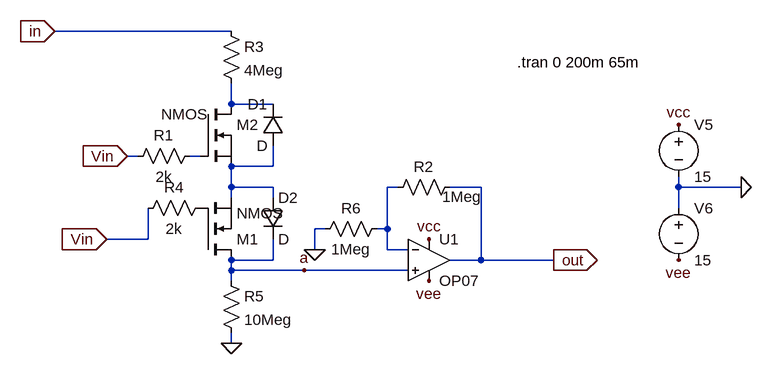
[diagram p0: schematic Voltage_controlled_switch_1.asc]
Voltage_controlled_switch_1.asc, the LTspice schematic file:
Version 4.1
SHEET 1 1524 680
WIRE 448 0 176 0
WIRE 448 112 448 80
WIRE 512 112 448 112
WIRE 304 192 288 192
WIRE 400 192 384 192
WIRE 512 208 512 176
WIRE 512 208 448 208
WIRE 448 240 448 208
WIRE 512 240 448 240
WIRE 704 240 688 240
WIRE 832 240 784 240
WIRE 1136 240 1136 224
WIRE 1232 240 1136 240
WIRE 448 256 448 240
WIRE 512 256 512 240
WIRE 1136 272 1136 240
WIRE 592 304 576 304
WIRE 688 304 688 240
WIRE 688 304 672 304
WIRE 320 320 320 272
WIRE 320 320 256 320
WIRE 576 336 576 304
WIRE 688 336 688 304
WIRE 720 336 688 336
WIRE 512 352 512 320
WIRE 512 352 448 352
WIRE 832 352 832 240
WIRE 832 352 784 352
WIRE 944 352 832 352
WIRE 448 368 448 352
WIRE 560 368 448 368
WIRE 720 368 560 368
WIRE 448 384 448 368
WIRE 448 480 448 464
FLAG 448 480 0
FLAG 576 336 0
FLAG 1232 240 0
FLAG 1136 144 vcc
FLAG 752 320 vcc
FLAG 1136 352 vee
FLAG 752 384 vee
FLAG 560 368 a
FLAG 176 0 in
IOPIN 176 0 In
FLAG 944 352 out
IOPIN 944 352 Out
FLAG 288 192 Vin
IOPIN 288 192 In
FLAG 256 320 Vin
IOPIN 256 320 In
SYMBOL res 400 176 R90
WINDOW 0 0 56 VBottom 2
WINDOW 3 32 56 VTop 2
SYMATTR InstName R1
SYMATTR Value 2k
SYMBOL res 800 224 R90
WINDOW 0 0 56 VBottom 2
WINDOW 3 15 -3 VTop 2
SYMATTR InstName R2
SYMATTR Value 1Meg
SYMBOL res 432 -16 R0
SYMATTR InstName R3
SYMATTR Value 4Meg
SYMBOL nmos 400 112 R0
WINDOW 3 -60 16 Left 2
SYMATTR InstName M2
SYMBOL nmos 400 352 M180
SYMATTR InstName M1
SYMBOL diode 496 256 R0
SYMATTR InstName D2
SYMBOL res 416 256 R90
WINDOW 0 0 56 VBottom 2
WINDOW 3 32 56 VTop 2
SYMATTR InstName R4
SYMATTR Value 2k
SYMBOL res 432 368 R0
SYMATTR InstName R5
SYMATTR Value 10Meg
SYMBOL diode 528 176 R180
WINDOW 0 24 64 Left 2
WINDOW 3 24 0 Left 2
SYMATTR InstName D1
SYMBOL OpAmps\\OP07 752 288 R0
SYMATTR InstName U1
SYMBOL res 688 288 R90
WINDOW 0 0 56 VBottom 2
WINDOW 3 32 56 VTop 2
SYMATTR InstName R6
SYMATTR Value 1Meg
SYMBOL voltage 1136 128 R0
WINDOW 123 0 0 Left 0
WINDOW 39 0 0 Left 0
SYMATTR InstName V5
SYMATTR Value 15
SYMBOL voltage 1136 256 R0
WINDOW 123 0 0 Left 0
WINDOW 39 0 0 Left 0
SYMATTR InstName V6
SYMATTR Value 15
TEXT 888 48 Left 2 !.tran 0 200m 65m

The netlist it stands for:
* Voltage_controlled_switch_1.asc
R1 N002 Vin 2k
R2 out N004 1Meg
R3 in N001 4Meg
M2 N001 N002 N003 N003 NMOS
M1 a P001 N003 N003 NMOS
D2 N003 a D
R4 P001 Vin 2k
R5 a 0 10Meg
D1 N003 N001 D
X§U1 a N004 vcc vee out LT1001  ; OP07, pins In+ In- V+ V- OUT
R6 N004 0 1Meg
V5 vcc 0 15
V6 0 vee 15
.model D D
.lib standard.dio
.model NMOS NMOS
.model PMOS PMOS
.lib standard.mos
.tran 0 200m 65m
.lib LTC.lib
.backanno
.end